# EAGLE design shema (EAGLE 9.4.2)

## Sheet 1 of 2
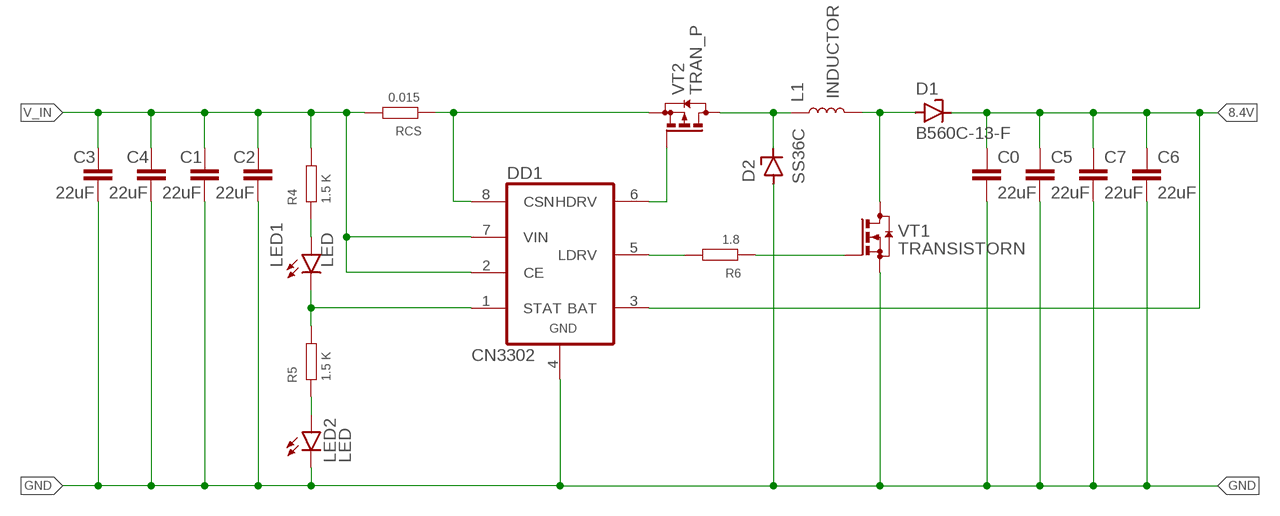
[diagram p0: schematic, sheet 1]

### Parts
C0  22uF  CAPACITOR  [1206]
C1  22uF  CAPACITOR  [1206]
C2  22uF  CAPACITOR  [1206]
C3  22uF  CAPACITOR  [1206]
C4  22uF  CAPACITOR  [1206]
C5  22uF  CAPACITOR  [1206]
C6  22uF  CAPACITOR  [1206]
C7  22uF  CAPACITOR  [1206]
D1  B560C-13-F  [CB417-15]
D2  SS36C  [DIOD]
DD1  CN3302  [SOP-8]
L1  INDUCTOR  [SMD]
LED1  LED  [1206]
LED2  LED  [1206]
R4  1.5 K  RESISTOR0603  [0603]
R5  1.5 K  RESISTOR0603  [0603]
R6  1.8  RESISTOR0603  [0603]
RCS  0.015  RESISTOR  [2512]
VT1  TRANSISTORN  [PDFN5*6-8L]
VT2  TRAN_P  [SOP-8]

### Nets
8.4V: C0.P$1 C5.P$1 C6.P$1 C7.P$1 D1.C DD1.3(BAT)
GND: C0.P$2 C1.P$2 C2.P$2 C3.P$2 C4.P$2 C5.P$2 C6.P$2 C7.P$2 D2.A DD1.4(GND) LED2.C VT1.P$5(S) VT1.P$6(S) VT1.P$7(S)
N$1: LED2.A R5.P$1
N$4: DD1.8(CSN) RCS.P$1 VT2.P$1(S) VT2.P$2(S) VT2.P$3(S)
N$5: D2.C L1.P$1 VT2.P$5(D) VT2.P$6(D) VT2.P$7(D) VT2.P$8(D)
N$6: D1.A L1.P$2 VT1.P$1(D) VT1.P$2(D) VT1.P$3(D) VT1.P$4(D) VT1.P$9(D)
N$8: DD1.5(LDRV) R6.P$2
N$9: R6.P$1 VT1.P$8(G)
N$10: DD1.6(HDRV) VT2.P$4(G)
N$11: DD1.1(STAT) LED1.C R5.P$2
N$12: LED1.A R4.P$1
V_IN: C1.P$1 C2.P$1 C3.P$1 C4.P$1 DD1.2(CE) DD1.7(VIN) R4.P$2 RCS.P$2

## Sheet 2 of 2

## Library data of the parts
C0 C5-C7 = 1_RESISTOR:CAPACITOR; SPICEPREFIX: C
C1-C4 = 1_RESISTOR:CAPACITOR
D1 = 1_DIOD:B560C-13-F
D2 = 1_DIOD:SS36C
DD1 = 1_MICRO:CN3302
L1 = 1_NDUCTORS:INDUCTOR
LED1 LED2 = 1_LED:LED
R4-R6 RCS = 1_RESISTOR:RESISTOR
VT1 = 1_TRANSISTOR (2):TRANSISTORN
VT2 = 1_TRANSISTOR (2):TRAN_P

## Board
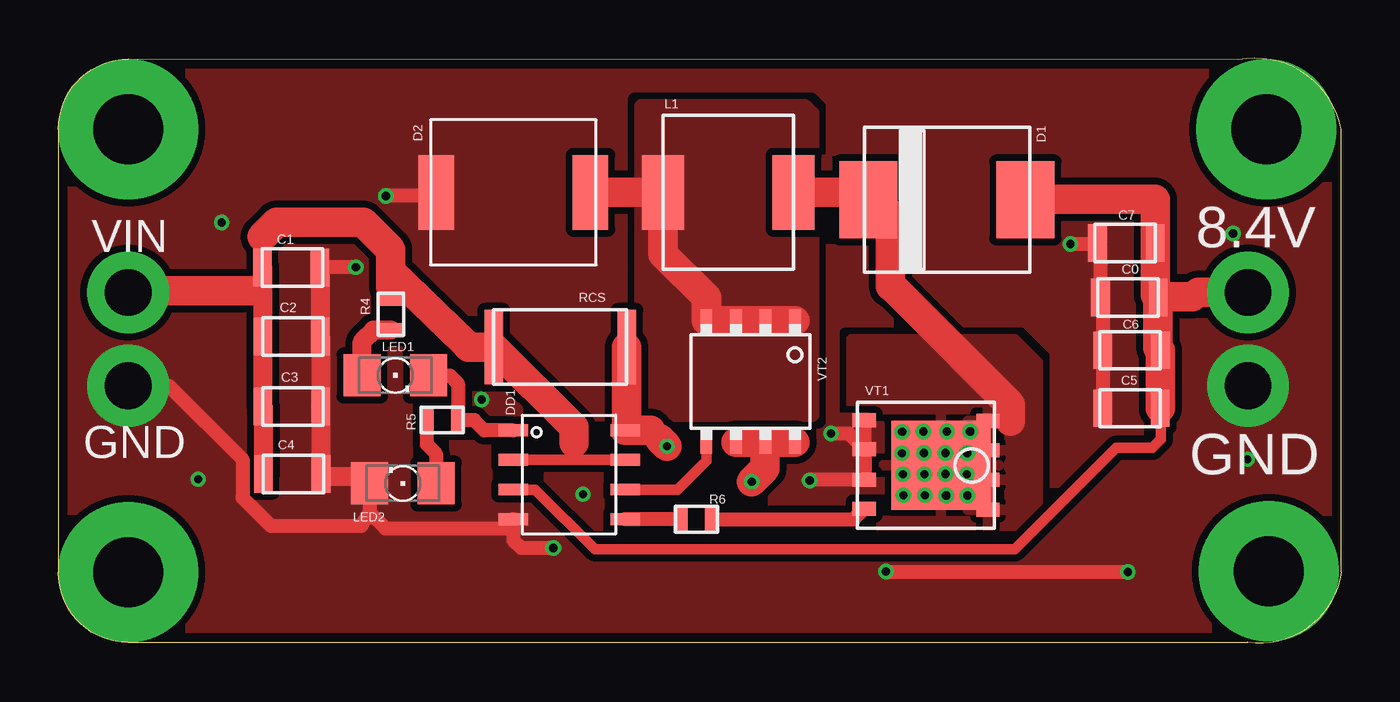
[diagram p1: board, top side]
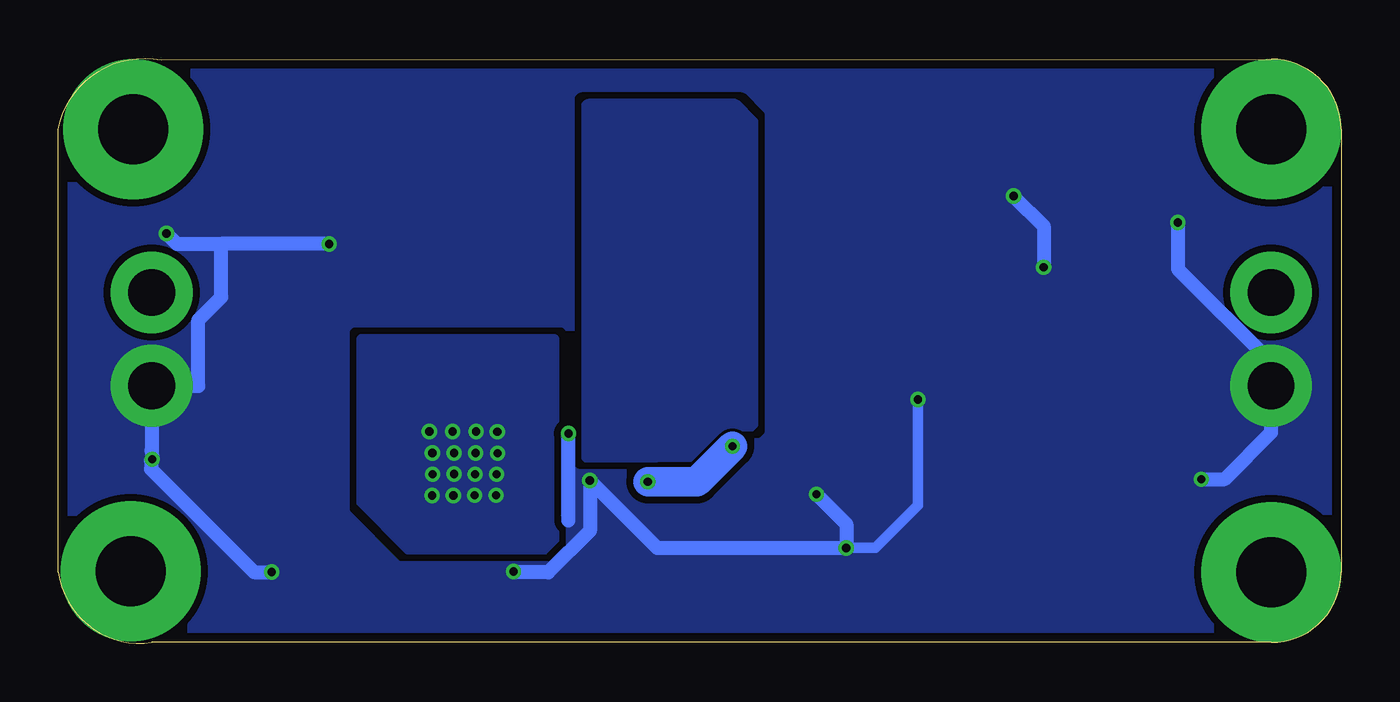
[diagram p2: board, bottom side, seen from below]

Size 55 x 25.07 mm. Coordinates in mm from the lower left corner, seen from the top.
Outline: 3,0.03 51,0.03 arc90 55,3.03 55,22.03 arc90 50.59,25 3,25.03 arc90 0,22.03 0,3.03 arc90 3,0.03
Copper layers (1*16): Top 0.035mm / dielectric 1.6mm / Bottom 0.035mm
Design rules "rezonit": minimum track width 0.125mm, minimum drill 0.3mm, track to track 0.125mm, track to pad 0.2mm, pad to pad 0.125mm, via to via 0.2mm, smd to smd 0mil, copper to edge 0.4mm, drill to drill 8mil, minimum pad ring 0.2mm, minimum via ring 0.15mm, stop-mask expansion 0.1mm, vias tented up to drill 3mm, thermal gap 10mil

### Footprints (pad centres in the part's own frame; a part is rotated, then mirrored left to right if it is on the bottom)
1206 = smd 0.8 x 1.6: P$1 -1.234,0; P$2 1.241,0
CB417-15 = smd 2.5 x 3.3: A -3.379,0; C 3.355,0
DIOD = smd 1.52 x 3.2: A -3.305,0; C 3.305,0
SOP-8 = smd 0.51 x 1.27: 1 -1.905,-2.4; 2 -0.635,-2.4; 3 0.635,-2.4; 4 1.905,-2.4; 5 1.905,2.4; 6 0.635,2.4; 7 -0.635,2.4; 8 -1.905,2.4
SMD = smd 1.8 x 3.2: P$1 -2.8,0; P$2 2.8,0
1206' = smd 1.6 x 1.803: A -1.422,0; C 1.422,0
0603 = smd 0.6 x 1.1: P$1 -0.67,0; P$2 0.678,0
2512 = smd 0.8 x 3.2: P$1 -2.85,0; P$2 2.85,0
PDFN5*6-8L = smd 0.6 x 1: P$1 -1.905,2.65; P$2 -0.635,2.65; P$3 0.635,2.65; P$4 1.905,2.65; P$5 -1.919,-2.65; P$6 -0.69,-2.65; P$7 0.635,-2.65; P$8 1.864,-2.65 | smd 3.82 x 4.25: P$9 0,0.635
SOP-8' = smd 0.51 x 1: P$1 -1.905,2.6; P$2 -0.635,2.6; P$3 0.635,2.6; P$4 1.905,2.6; P$5 -1.905,-2.6; P$6 -0.635,-2.6; P$7 0.635,-2.6; P$8 1.905,-2.6

### Placement (x,y rotation side)
C0  45.91,14.82 180 top
C1  9.98,16.1 0 top
C2  10,13.14 0 top
C3  10.01,10.14 0 top
C4  10.03,7.25 0 top
C5  46.01,10.07 180 top
C6  46.01,12.56 180 top
C7  45.79,17.15 180 top
D1  38.11,19 0 top
D2  19.51,19.32 0 top
DD1  21.9,7.22 270 top
L1  28.72,19.32 0 top
LED1  LED  [1206']  14.45,11.48 0 top
LED2  LED  [1206']  14.77,6.85 180 top
R4  14.26,14.09 90 top
R5  16.46,9.56 0 top
R6  27.35,5.31 180 top
RCS  21.52,12.69 180 top
VT1  37.2,7.63 270 top
VT2  TRAN_P  [SOP-8']  29.68,11.22 180 top

### Tracks (layer width: path | path; a pad name or v marks a point on that pad's centre or on a via)
8.4V  (via drill 2 pad 3.5)
  Top 0.45: DD1.3 20.45,6.59 23,4.03 41,4.03 45.35,8.39 46.91,8.39 47.27,8.74 47.27,10.05 C5.P$1 | C6.P$1 47.15,12.66 | 47.02,14.94 C0.P$1 47.19,14.86 47.75,14.86
  Top 1.27: C5.P$1 C6.P$1 | 47.15,12.66 C0.P$1 | 47.02,14.94 C7.P$1 47.02,19.01 47,19.03 41.49,19.03 D1.C | v51,15.03 48.88,15.03 48.61,14.86 47.75,14.86
GND  (via drill 0.35, 2 pad 3.5)
  Top 0.45: LED2.C 13.35,6.03 | 44.67,17.03 C7.P$2 44.51,17.11 | C0.P$2 44.77,14.72 | C5.P$2
  Top 0.6: v3,11.03 4.74,11.03 7.9,7.88 7.9,6.25 9.11,5.03 13,5.03 | v45.86,3.05 45.84,3.04 35.51,3.04 v35.48,3.08 | 12.93,7.27 12.73,7.27 12.88,7.13 | 12.88,7.13 12.93,7.13 | VT1.P$6 33.89,8.99 v33.13,8.99 | 14.03,4.92 13.35,5.6 | 13.33,6.67 12.88,7.13 | 13.35,6.03 13.35,5.6 | 13.01,5.05 13.35,5.6 | VT1.P$7 32.24,7 v32.21,6.97 | DD1.4 19.51,4.42 19.85,4.08 v21.22,4.08 | 44.67,17.03 C0.P$2 | 44.77,14.72 C6.P$2 C5.P$2 | v43.39,17.11 44.51,17.11
  Top 0.61: 19.5,5.3 19.12,4.92 14.03,4.92 | VT1.P$5 VT1.P$6 VT1.P$7 | LED2.C 12.93,7.27 | 11.24,16.12 C1.P$2 v12.76,16.11 | D2.A 16.06,19.18 14.06,19.18 v14.04,19.17
  Top 0.813: C1.P$2 11.22,13.16 C2.P$2 C3.P$2 11.25,7.27 | 11.25,7.27 11.25,7.13 12.93,7.13 | 11.25,7.27 C4.P$2
  Bottom 0.45: v18.14,10.45 18.14,5.92 19.98,4.08 v21.22,4.08
  Bottom 0.6: 33.13,5.26 v33.13,8.99 | v7,18.03 7,16.03 3,12.03 v3,11.03 3,9.03 5,7.03 v6,7.03 | v45.86,3.05 46.61,3.05 51.02,7.46 51.02,7.83 v50.98,7.89 50.98,7.96 51,8.25 v51,11.03 49,11.03 49,13.85 48.01,14.83 48.01,17.11 | v43.39,17.11 48.01,17.11 | v50.36,17.56 49.92,17.11 48.01,17.11 | v22.49,6.38 21.22,5.11 v21.22,4.08 | v32.21,6.97 32.21,4.82 34,3.03 35.43,3.03 v35.48,3.08
  Bottom 0.61: v32.21,6.97 29.32,4.08 v21.22,4.08 | v14.04,19.17 12.76,17.88 v12.76,16.11
  pour Top (isolate 0.3, rank 4, no thermals): -1,26.03 56,26.03 56,-0.97 -1,-0.97
  pour Bottom (isolate 0.3, rank 3): 0,25.03 0,0.03 55,0.03 55,25.03
N$1
  Top 0.6: R5.P$1 15.78,9.55
  Top 0.61: R5.P$1 15.79,8.52 16.19,8.12 LED2.A
N$2  (via drill 3 pad 6)
  other vias: 51.8,22.03
N$3  (via drill 3 pad 6)
  other vias: 3,3.03
N$4  (via drill 0.35)
  Top 0.6: VT2.P$2 30.3,8.62 | 25.75,8.78 25.74,8.78 25.4,9.13 | 24.37,9.2 DD1.8
  Top 1.27: VT2.P$1 VT2.P$2 | VT2.P$3 30.3,8.62 30.3,7.5 v29.73,6.92 | v26.09,8.44 25.75,8.78 | 25.4,9.13 DD1.8 | RCS.P$1 24.37,9.2
  Bottom 1.27: v29.73,6.92 27.61,6.92 v26.09,8.44
N$5
  Top 0.61: D2.C
  Top 1.27: VT2.P$5 VT2.P$6 VT2.P$7 VT2.P$8 27.78,14.82 25.92,16.68 L1.P$1 D2.C
  pour Top (isolate 0.3, no thermals): 32.32,9.78 25,9.78 25,23.03 32,23.03 32.32,22.72
  pour Bottom: 26.63,8.08 25.27,9.43 25.27,22.31 26,23.03 32.27,23.03 32.29,23.01 32.29,8.03 32,8.03
N$6  (via drill 0.35)
  Top 0.45: 35.68,18.35 35.52,18.51 35.03,19 D1.A 34.71,19.02 34.71,19.32
  Top 0.6: 39.22,7.63 VT1.P$2 | VT1.P$9 39.22,7.63 | 39.22,7.63 VT1.P$3
  Top 0.61: VT1.P$4 VT1.P$3 | VT1.P$1 39.74,9.54 VT1.P$9 39.72,9.51 40.81,9.51 | D1.A 34.7,18.98
  Top 1.27: 40.81,9.51 40.81,10.22 35.73,15.3 35.68,15.3 35.68,18.35 | L1.P$2 34.71,19.32 35.52,18.51
  other vias: 36.18,9.06 36.17,8.15 37.11,8.16 38.04,8.16 38.96,8.15 36.21,7.24 37.14,7.24 38.03,7.25 38.95,7.24 36.23,6.34 37.15,6.34 38.06,6.33 38.98,6.33 37.1,9.07 38.1,9.07 39.1,9.07
  pour Bottom (isolate 0.3): 33.74,13.03 42,13.03 42,6.03 40,4.03 34,4.03 33.74,4.29
  pour Top (isolate 0.3): 34,13.03 41,13.03 42,12.03 42,6.03 41,5.03 34,5.03
N$8
  Top 0.61: R6.P$2 DD1.5
N$9
  Top 0.61: R6.P$1 34.09,5.31 VT1.P$8
N$10
  Top 0.45: VT2.P$4 27.78,7.81 26.55,6.59 DD1.6
N$11
  Top 0.6: LED1.C 16.78,11.48 17.14,11.13 R5.P$2
  Top 0.61: DD1.1 18.26,9.13 17.83,9.56 R5.P$2
N$12
  Top 0.813: R4.P$1 13.51,13.42 13.03,12.94 LED1.A
N$16  (via drill 3 pad 6)
  other vias: 3,22.03
N$17  (via drill 3 pad 6)
  other vias: 51.9,3.1
V_IN  (via drill 2 pad 3.5)
  Top 0.406: 8.75,16.34 C1.P$1
  Top 0.45: DD1.2 22,7.86 | 22,7.86 DD1.7 | 22.1,9.26 22,9.16 22,7.86
  Top 0.6: 8.25,15.11 8.63,15.11 8.75,15.23 C1.P$1 8.77,16.08 | 17.62,12.68 17.41,12.9 17.41,12.87 15.41,14.78
  Top 0.61: C4.P$1 8.74,7.2 | 8.75,17.42 8.75,16.34 | 14.25,15.29 14.26,15.29 R4.P$2 15.41,14.78 | 18.66,12.68 RCS.P$2 18.67,11.78
  Top 0.813: C4.P$1 8.8,10.12 C3.P$1 C2.P$1 8.77,16.08
  Top 1.27: 13.08,18.04 9.36,18.04 8.75,17.42 | v3,15.03 3.1,15.11 8.25,15.11 | 14.21,16.9 14.25,16.86 14.25,15.95 | 14.25,15.95 14.25,15.29 | 14.25,15.95 17.41,12.87 17.59,12.69 RCS.P$2 22.1,9.26 22.1,8.58
  Top 1.277: 13.08,18.04 14.21,16.9

### Text on the board
tNames: VIN | 8.4V | GND | GND